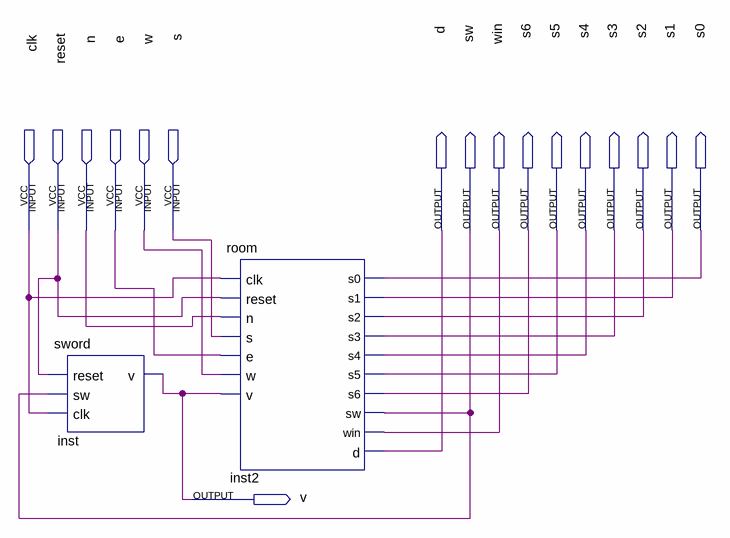
[diagram p0: schematic sheet]
// Quartus schematic Game_sec_02.bdf as structural Verilog: 2 symbols, 17 pins
module Game_sec_02 (
  input  clk,
  input  reset,
  input  n,
  input  e,
  input  w,
  input  s,
  output d,
  output sw,
  output win,
  output s6,
  output s5,
  output s4,
  output s3,
  output s2,
  output s1,
  output s0,
  output v
);

  sword inst (.reset(reset), .sw(sw), .clk(clk), .v(v));
  room inst2 (
    .clk(clk), .reset(reset), .n(n), .s(s), .e(e), .w(w), .v(v), .s0(s0), .s1(s1), .s2(s2), .s3(s3), .s4(s4),
    .s5(s5), .s6(s6), .sw(sw), .win(win), .d(d));
endmodule
